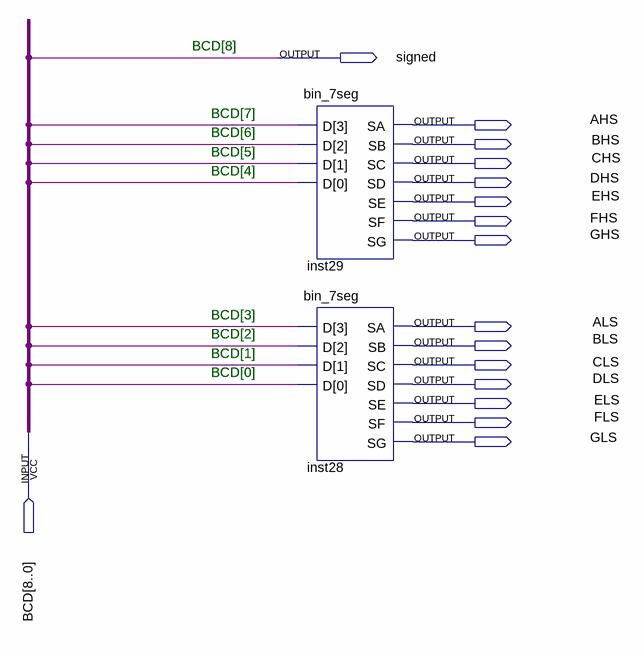
[diagram p0: schematic sheet]
// Quartus schematic decoder.bdf as structural Verilog: 2 symbols, 16 pins
module decoder (
  input  [8:0] BCD,
  output \signed ,
  output AHS,
  output BHS,
  output CHS,
  output DHS,
  output EHS,
  output FHS,
  output GHS,
  output ALS,
  output BLS,
  output CLS,
  output DLS,
  output ELS,
  output FLS,
  output GLS
);

  bin_7seg inst29 (.D(BCD[7:4]), .SA(AHS), .SB(BHS), .SC(CHS), .SD(DHS), .SE(EHS), .SF(FHS), .SG(GHS));
  bin_7seg inst28 (.D(BCD[3:0]), .SA(ALS), .SB(BLS), .SC(CLS), .SD(DLS), .SE(ELS), .SF(FLS), .SG(GLS));

  assign \signed  = BCD[8];

  // Notes on the sheet:
  //   BCD[8]
  //   BCD[7]
  //   BCD[6]
  //   BCD[5]
  //   BCD[4]
  //   BCD[3]
  //   BCD[2]
  //   BCD[1]
  //   BCD[0]
endmodule
